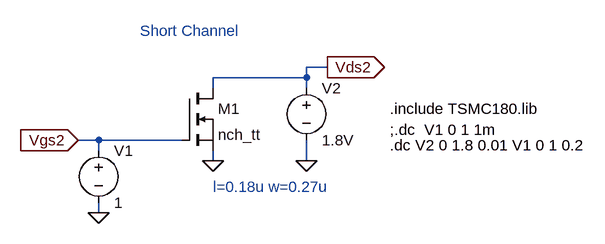
[diagram p0: schematic Prob_4b1.asc]
Prob_4b1.asc, the LTspice schematic file:
Version 4
SHEET 1 880 680
WIRE 288 80 256 80
WIRE 256 96 256 80
WIRE 256 96 112 96
WIRE 112 112 112 96
WIRE 256 112 256 96
WIRE -64 192 -96 192
WIRE 64 192 -64 192
WIRE -64 208 -64 192
WIRE 112 224 112 208
WIRE 256 224 256 192
WIRE -64 304 -64 288
FLAG -64 304 0
FLAG 112 224 0
FLAG 256 224 0
FLAG -96 192 Vgs2
IOPIN -96 192 In
FLAG 288 80 Vds2
IOPIN 288 80 Out
SYMBOL nmos 64 112 R0
SYMATTR InstName M1
SYMATTR Value nch_tt
SYMATTR Value2 l=0.18u w=0.27u
SYMBOL voltage -64 192 R0
WINDOW 123 0 0 Left 0
WINDOW 39 0 0 Left 0
SYMATTR InstName V1
SYMATTR Value 1
SYMBOL voltage 256 96 R0
WINDOW 123 0 0 Left 0
WINDOW 39 0 0 Left 0
SYMATTR InstName V2
SYMATTR Value 1.8V
TEXT 0 24 Left 2 ;Short Channel
TEXT 384 144 Left 2 !.include TSMC180.lib
TEXT 384 200 Left 2 !.dc V2 0 1.8 0.01 V1 0 1 0.2
TEXT 384 176 Left 2 !;.dc  V1 0 1 1m
TEXT 112 264 Left 2 ;l=0.18u w=0.27u

The netlist it stands for:
* Prob_4b1.asc
M1 Vds2 Vgs2 0 0 nch_tt l=0.18u w=0.27u
V1 Vgs2 0 1
V2 Vds2 0 1.8V
.model NMOS NMOS
.model PMOS PMOS
.lib standard.mos
* Short Channel
.include TSMC180.lib
.dc V2 0 1.8 0.01 V1 0 1 0.2
;.dc  V1 0 1 1m
* l=0.18u w=0.27u
.backanno
.end